# Altium project 06-7Segment(MAX7219).PrjPcb
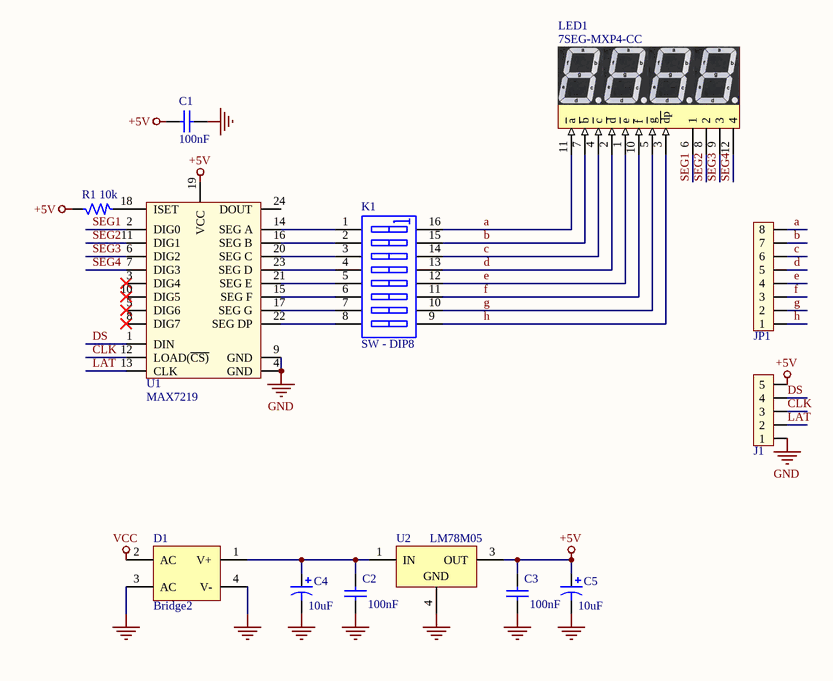
[diagram p0: 06-7Segment(MAX7219).SchDoc]
1 sheet, 13 parts. Net scope: global (net labels, ports and power ports of the same name join across sheets).
Board file: 06-7Segment(MAX7219).PcbDoc

## Sheet 06-7Segment(MAX7219).SchDoc
size A

### Parts
C1  value 100nF  [RAD-0.3]  (hidden comment: 104)
C2  value 100nF  [RAD-0.3]  (hidden comment: 104)
C3  value 100nF  [RAD-0.3]  (hidden comment: 104)
C4  value 10uF  [RB7.6-15]  (hidden comment: 10uF/16V)
C5  value 10uF  [RB7.6-15]  (hidden comment: 10uF/16V)
D1  Bridge2  [D-46_6A]
J1  JP5  [JP5]  (value not drawn)
JP1  JP8 PIN  [JP8-2.54]  (value not drawn)
K1  SW - DIP8  [SW-DIP-16]
LED1  7SEG-MXP4-CC  [7seg4 - 0.36 GREEN]
R1  10k  [R-0805]
U1  MAX7219  [SOIC-24-W]
U2  value LM78M05  [NDP0003B_M]  (hidden comment: LM78M05CDTX)

### Nets
+5V: C1.1 C3.1 C5.1 J1.5 R1.1 U1.19(VCC) U2.3(OUT)
GND: C1.2 C2.2 C3.2 C4.2 C5.2 D1.3(AC) D1.4(V-) J1.1 U1.4(GND) U1.9(GND) U2.4(GND)
VCC: D1.2(AC)
a: JP1.8 K1.16(B1) LED1.11(~{a})
b: JP1.7 K1.15(B2) LED1.7(~{b})
c: JP1.6 K1.14(B3) LED1.4(~{c})
CLK: J1.3 U1.12(LOAD(~{CS)})
d: JP1.5 K1.13(B4) LED1.2(~{d})
DS: J1.4 U1.1(DIN)
e: JP1.4 K1.12(B5) LED1.1(~{e})
f: JP1.3 K1.11(B6) LED1.10(~{f})
g: JP1.2 K1.10(B7) LED1.5(~{g})
h: JP1.1 K1.9(B8) LED1.3(~{dp})
LAT: J1.2 U1.13(CLK)
SEG1: LED1.6(1) U1.2(DIG0)
SEG2: LED1.8(2) U1.11(DIG1)
SEG3: LED1.9(3) U1.6(DIG2)
SEG4: LED1.12(4) U1.7(DIG3)
NetC2_1: C2.1 C4.1 D1.1(V+) U2.1(IN)
NetK1_1: K1.1(A1) U1.14(SEG_A)
NetK1_2: K1.2(A2) U1.16(SEG_B)
NetK1_3: K1.3(A3) U1.20(SEG_C)
NetK1_4: K1.4(A4) U1.23(SEG_D)
NetK1_5: K1.5(A5) U1.21(SEG_E)
NetK1_6: K1.6(A6) U1.15(SEG_F)
NetK1_7: K1.7(A7) U1.17(SEG_G)
NetK1_8: K1.8(A8) U1.22(SEG_DP)
NetR1_2: R1.2 U1.18(ISET)

Not connected (* = marked no-connect by the designer): U1 3(DIG4)* 5(DIG6)* 8(DIG7)* 10(DIG5)* 24(DOUT)

### Library data of the parts
C1-C3 = Cap: Capacitor; Published: 8-Jun-2000; LatestRevisionDate: 17-Jul-2002; LatestRevisionNote: Re-released for DXP Platform.; PackageReference: RAD-0.3; Publisher: Altium Limited; PackageDescription: Radial Cap, Thru-Hole; 2 Leads; 0.3 in Pin Spacing
C4 C5 = Cap Pol1: Polarized Capacitor (Radial); Published: 8-Jun-2000; LatestRevisionDate: 17-Jul-2002; LatestRevisionNote: Re-released for DXP Platform.; PackageReference: RB7.6-15; Publisher: Altium Limited; PackageDescription: Polarized Capacitor (Radial); 2 Leads
D1 = Bridge2: Diode Bridge; Published: 24-Mar-1999; LatestRevisionDate: 17-Jul-2002; LatestRevisionNote: Re-released for DXP Platform.; PackageReference: D-46_6A; Publisher: Altium Limited; PackageDescription: Bridge Rectifier; 4 Terminals; Body 16.8 x 16.8 mm (typ); Pitch 10.67 mm
JP1 = JP8: Value: JP7
K1 = SWDIP-8: DIP Switch, 8 Position, SPST; Value: SW - DIP8
LED1 = 7SEG-MXP4-CA: Four 7-segment led; Value: 7SEG-MXP4-CA
R1 = R: Resistor 1/4W; Value: R1/4W - 1K
U2 = CMP-0062-00204-3: 3-Terminal Positive Voltage Regulators, 3-pin TO-252; Manufacturer: Texas Instruments; PackageTopMarking: NSUZXYTT*LM78M05*CDT; PowerWise: N; CompType: LDO IC; ComponentLink1Description: Datasheet URL; ComponentLink1URL: http://www.ti.com/general/docs/lit/getliterature.tsp?genericPartNumber=LM78M05&fileType=pdf; PackageReference: NDP0003B; Code_JEDEC: TO-252-AA; PinCount: 3; PackageDescription: TO252, Molded, Jedec, 6.8 x 6.10 x 2.30mm Body, 3 Lead, 2.28mm Pitch, Surface Mount
U1 = MAX7219: Value: MAX7219